# Altium schematic sheet P05-SD_WIFI.SchDoc
size 420 x 297 mm
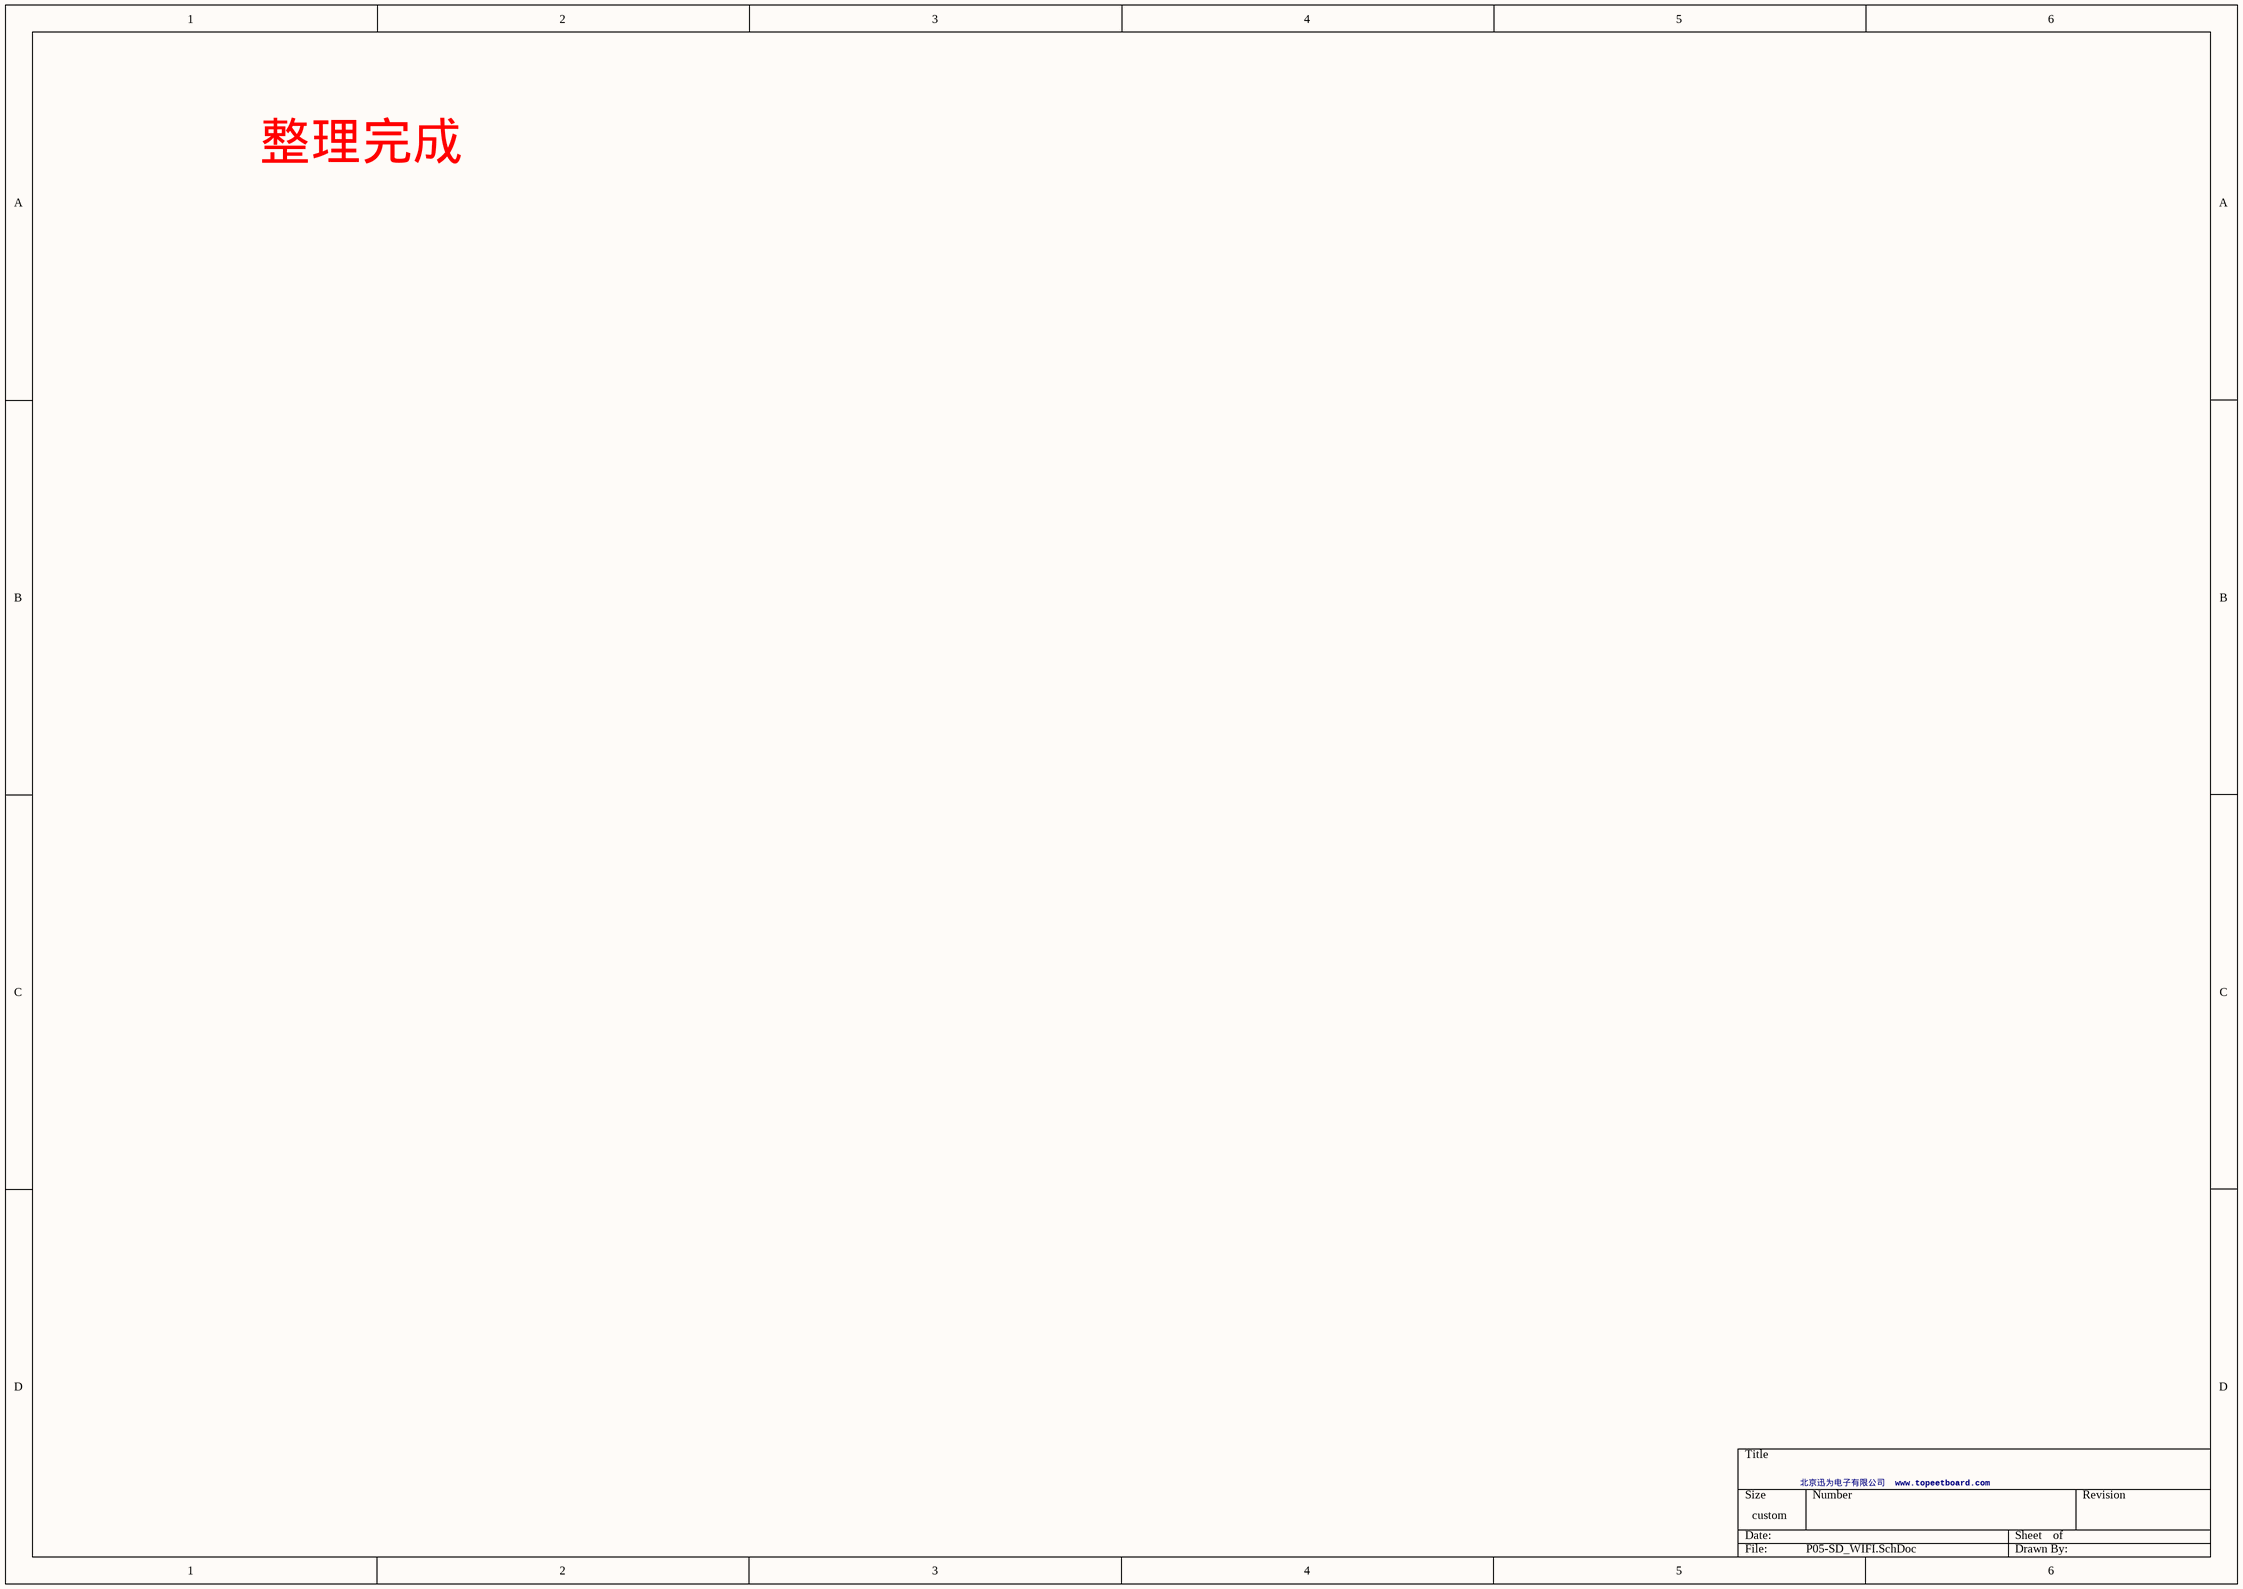
[diagram p0: P05-SD_WIFI.SchDoc]

## Notes on the sheet
- 整理完成
- 北京迅为电子有限公司  www.topeetboard.com